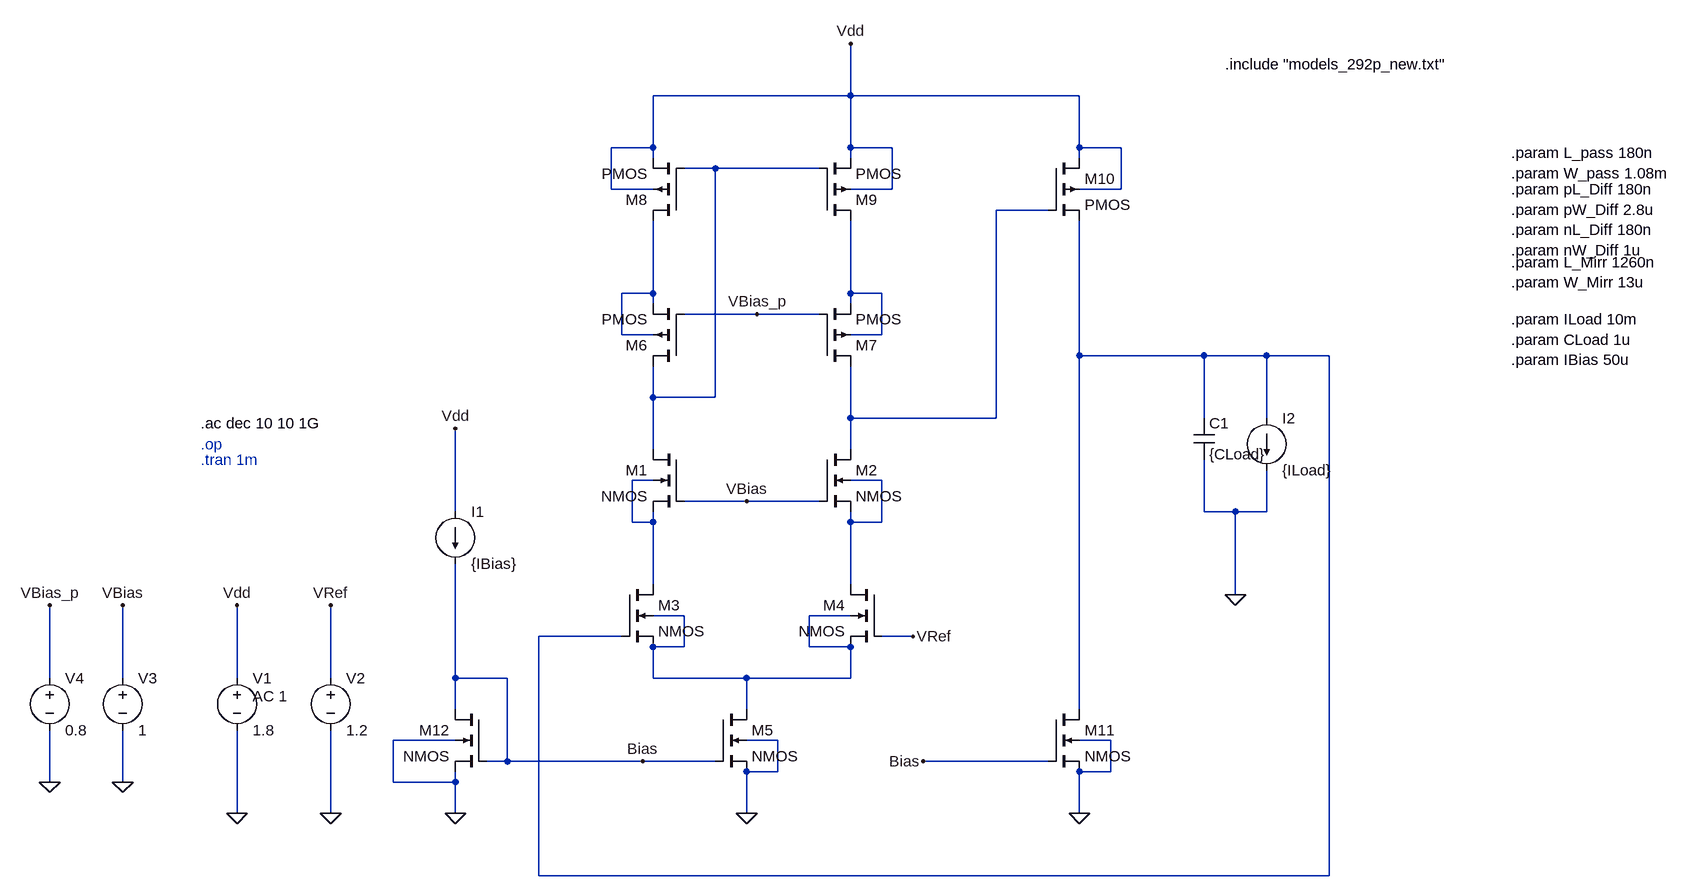
[diagram p0: schematic LDO_Telescopic_CL.asc]
LDO_Telescopic_CL.asc, the LTspice schematic file:
Version 4
SHEET 1 1696 888
WIRE 416 -368 416 -448
WIRE 416 -368 112 -368
WIRE 768 -368 416 -368
WIRE 112 -288 112 -368
WIRE 112 -288 48 -288
WIRE 416 -288 416 -368
WIRE 480 -288 416 -288
WIRE 768 -288 768 -368
WIRE 832 -288 768 -288
WIRE 112 -272 112 -288
WIRE 416 -272 416 -288
WIRE 768 -272 768 -288
WIRE 208 -256 160 -256
WIRE 368 -256 208 -256
WIRE 48 -224 48 -288
WIRE 112 -224 48 -224
WIRE 480 -224 480 -288
WIRE 480 -224 416 -224
WIRE 832 -224 832 -288
WIRE 832 -224 768 -224
WIRE 720 -192 640 -192
WIRE 112 -64 112 -176
WIRE 112 -64 64 -64
WIRE 416 -64 416 -176
WIRE 464 -64 416 -64
WIRE 112 -48 112 -64
WIRE 416 -48 416 -64
WIRE 272 -32 160 -32
WIRE 368 -32 272 -32
WIRE 64 0 64 -64
WIRE 112 0 64 0
WIRE 464 0 464 -64
WIRE 464 0 416 0
WIRE 768 32 768 -176
WIRE 960 32 768 32
WIRE 1056 32 960 32
WIRE 1152 32 1056 32
WIRE 112 96 112 48
WIRE 208 96 208 -256
WIRE 208 96 112 96
WIRE 416 128 416 48
WIRE 640 128 640 -192
WIRE 640 128 416 128
WIRE 960 128 960 32
WIRE 1056 128 1056 32
WIRE 112 176 112 96
WIRE 416 176 416 128
WIRE 112 224 80 224
WIRE 464 224 416 224
WIRE 256 256 160 256
WIRE 368 256 256 256
WIRE -192 272 -192 144
WIRE 960 272 960 192
WIRE 1008 272 960 272
WIRE 1056 272 1056 208
WIRE 1056 272 1008 272
WIRE 80 288 80 224
WIRE 112 288 112 272
WIRE 112 288 80 288
WIRE 416 288 416 272
WIRE 464 288 464 224
WIRE 464 288 416 288
WIRE 112 384 112 288
WIRE 416 384 416 288
WIRE 1008 400 1008 272
WIRE 160 432 112 432
WIRE 416 432 352 432
WIRE 64 464 -64 464
WIRE 512 464 464 464
WIRE 160 480 160 432
WIRE 160 480 112 480
WIRE 352 480 352 432
WIRE 416 480 352 480
WIRE -816 528 -816 416
WIRE -704 528 -704 416
WIRE -528 528 -528 416
WIRE -384 528 -384 416
WIRE -192 528 -192 352
WIRE -112 528 -192 528
WIRE 112 528 112 480
WIRE 256 528 112 528
WIRE 416 528 416 480
WIRE 416 528 256 528
WIRE -192 576 -192 528
WIRE 256 576 256 528
WIRE 768 576 768 32
WIRE -192 624 -288 624
WIRE 304 624 256 624
WIRE 816 624 768 624
WIRE -112 656 -112 528
WIRE -112 656 -144 656
WIRE 96 656 -112 656
WIRE 208 656 96 656
WIRE 720 656 528 656
WIRE 304 672 304 624
WIRE 304 672 256 672
WIRE 816 672 816 624
WIRE 816 672 768 672
WIRE -816 688 -816 608
WIRE -704 688 -704 608
WIRE -288 688 -288 624
WIRE -192 688 -192 672
WIRE -192 688 -288 688
WIRE -528 736 -528 608
WIRE -384 736 -384 608
WIRE -192 736 -192 688
WIRE 256 736 256 672
WIRE 768 736 768 672
WIRE -64 832 -64 464
WIRE 1152 832 1152 32
WIRE 1152 832 -64 832
FLAG 256 736 0
FLAG 768 736 0
FLAG -192 736 0
FLAG 1008 400 0
FLAG -528 736 0
FLAG -384 736 0
FLAG -384 416 VRef
FLAG 512 464 VRef
FLAG -192 144 Vdd
FLAG -528 416 Vdd
FLAG 416 -448 Vdd
FLAG 528 656 Bias
FLAG 96 656 Bias
FLAG -704 688 0
FLAG -704 416 VBias
FLAG 256 256 VBias
FLAG -816 688 0
FLAG -816 416 VBias_p
FLAG 272 -32 VBias_p
SYMBOL nmos4 160 176 M0
SYMATTR InstName M1
SYMATTR Value2 l={nL_Diff} w={nW_Diff}
SYMBOL nmos4 368 176 R0
SYMATTR InstName M2
SYMATTR Value2 l={nL_Diff} w={nW_Diff}
SYMBOL nmos4 64 384 R0
SYMATTR InstName M3
SYMATTR Value2 l={nL_Diff} w={nW_Diff}
SYMBOL nmos4 464 384 M0
SYMATTR InstName M4
SYMATTR Value2 l={nL_Diff} w={nW_Diff}
SYMBOL nmos4 208 576 R0
SYMATTR InstName M5
SYMATTR Value2 l={L_Mirr} w={W_Mirr}
SYMBOL pmos4 160 48 R180
SYMATTR InstName M6
SYMATTR Value2 l={pL_Diff} w={pW_Diff}
SYMBOL pmos4 368 48 M180
SYMATTR InstName M7
SYMATTR Value2 l={pL_Diff} w={pW_Diff}
SYMBOL pmos4 160 -176 R180
SYMATTR InstName M8
SYMATTR Value2 l={pL_Diff} w={pW_Diff}
SYMBOL pmos4 368 -176 M180
SYMATTR InstName M9
SYMATTR Value2 l={pL_Diff} w={pW_Diff}
SYMBOL pmos4 720 -272 R0
SYMATTR InstName M10
SYMATTR Value2 l=L_pass w=W_pass
SYMBOL nmos4 720 576 R0
SYMATTR InstName M11
SYMATTR Value2 l={L_Mirr} w={W_Mirr}
SYMBOL current -192 272 R0
WINDOW 123 0 0 Left 0
WINDOW 39 0 0 Left 0
SYMATTR InstName I1
SYMATTR Value {IBias}
SYMBOL cap 944 128 R0
SYMATTR InstName C1
SYMATTR Value {CLoad}
SYMBOL current 1056 128 R0
WINDOW 123 0 0 Left 0
WINDOW 39 0 0 Left 0
SYMATTR InstName I2
SYMATTR Value {ILoad}
SYMBOL voltage -528 512 R0
WINDOW 123 24 44 Left 2
WINDOW 39 0 0 Left 0
SYMATTR Value2 AC 1
SYMATTR InstName V1
SYMATTR Value 1.8
SYMBOL voltage -384 512 R0
WINDOW 123 0 0 Left 0
WINDOW 39 0 0 Left 0
SYMATTR InstName V2
SYMATTR Value 1.2
SYMBOL nmos4 -144 576 M0
SYMATTR InstName M12
SYMATTR Value2 l={L_Mirr} w={W_Mirr}
SYMBOL voltage -704 512 R0
WINDOW 123 0 0 Left 0
WINDOW 39 0 0 Left 0
SYMATTR InstName V3
SYMATTR Value 1
SYMBOL voltage -816 512 R0
WINDOW 123 0 0 Left 0
WINDOW 39 0 0 Left 0
SYMATTR InstName V4
SYMATTR Value 0.8
TEXT 1432 -24 Left 2 !.param ILoad 10m\n.param CLoad 1u\n.param IBias 50u
TEXT 1432 -224 Left 2 !.param pL_Diff 180n\n.param pW_Diff 2.8u\n.param nL_Diff 180n\n.param nW_Diff 1u
TEXT 1432 -280 Left 2 !.param L_pass 180n\n.param W_pass 1.08m
TEXT 992 -416 Left 2 !.include "models_292p_new.txt"
TEXT 1432 -112 Left 2 !.param L_Mirr 1260n\n.param W_Mirr 13u
TEXT -584 136 Left 2 !.ac dec 10 10 1G
TEXT -584 168 Left 2 ;.op
TEXT -584 192 Left 2 ;.tran 1m

The netlist it stands for:
* LDO_Telescopic_CL.asc
M1 N001 VBias N006 N006 NMOS l={nL_Diff} w={nW_Diff}
M2 N002 VBias N007 N007 NMOS l={nL_Diff} w={nW_Diff}
M3 N006 N005 N008 N008 NMOS l={nL_Diff} w={nW_Diff}
M4 N007 VRef N008 N008 NMOS l={nL_Diff} w={nW_Diff}
M5 N008 Bias 0 0 NMOS l={L_Mirr} w={W_Mirr}
M6 N001 VBias_p N003 N003 PMOS l={pL_Diff} w={pW_Diff}
M7 N002 VBias_p N004 N004 PMOS l={pL_Diff} w={pW_Diff}
M8 N003 N001 Vdd Vdd PMOS l={pL_Diff} w={pW_Diff}
M9 N004 N001 Vdd Vdd PMOS l={pL_Diff} w={pW_Diff}
M10 Vdd N002 N005 Vdd PMOS l=L_pass w=W_pass
M11 N005 Bias 0 0 NMOS l={L_Mirr} w={W_Mirr}
I1 Vdd Bias {IBias}
C1 N005 0 {CLoad}
I2 N005 0 {ILoad}
V1 Vdd 0 1.8 AC 1
V2 VRef 0 1.2
M12 Bias Bias 0 0 NMOS l={L_Mirr} w={W_Mirr}
V3 VBias 0 1
V4 VBias_p 0 0.8
.model NMOS NMOS
.model PMOS PMOS
.lib standard.mos
.param ILoad 10m
.param CLoad 1u
.param IBias 50u
.param pL_Diff 180n
.param pW_Diff 2.8u
.param nL_Diff 180n
.param nW_Diff 1u
.param L_pass 180n
.param W_pass 1.08m
.include "models_292p_new.txt"
.param L_Mirr 1260n
.param W_Mirr 13u
.ac dec 10 10 1G
* .op
* .tran 1m
.backanno
.end